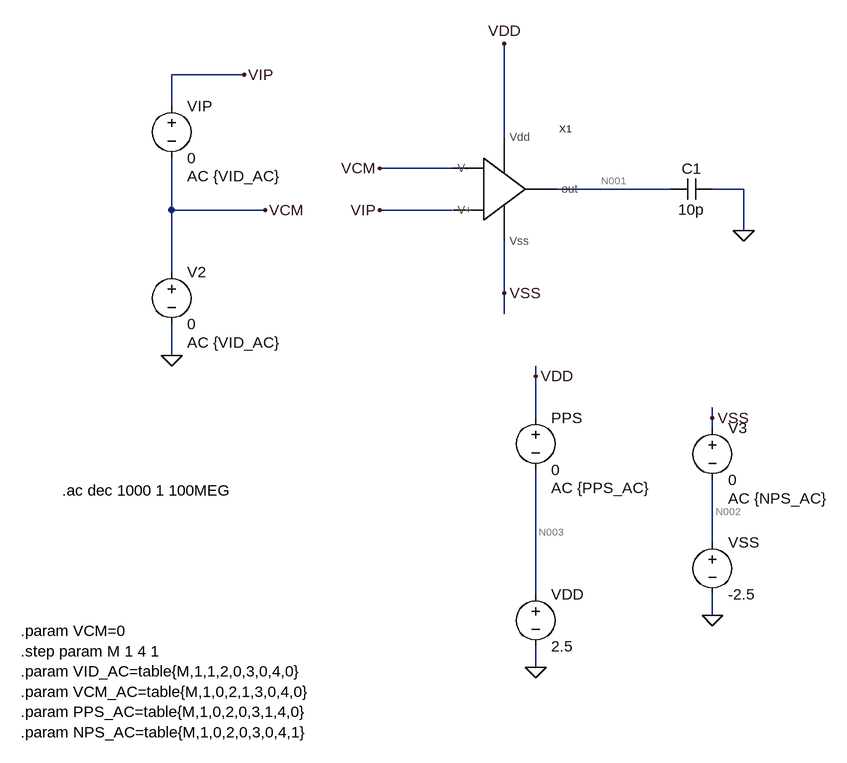
[diagram p0: schematic Draft3.asc]
Draft3.asc, the LTspice schematic file:
Version 4
SHEET 1 880 788
WIRE -432 -272 -544 -272
WIRE -544 -224 -544 -272
WIRE -32 -176 -32 -320
WIRE -112 -128 -224 -128
WIRE 224 -96 48 -96
WIRE 336 -96 288 -96
WIRE -544 -64 -544 -144
WIRE -400 -64 -544 -64
WIRE -112 -64 -224 -64
WIRE 336 -32 336 -96
WIRE -544 32 -544 -64
WIRE -32 64 -32 -16
WIRE -32 96 -32 64
WIRE -544 160 -544 112
WIRE 16 192 16 176
WIRE 16 256 16 192
WIRE 288 256 288 240
WIRE 288 272 288 256
WIRE 288 448 288 352
WIRE 16 528 16 336
WIRE 288 560 288 528
WIRE 16 640 16 608
FLAG -544 160 0
FLAG 288 560 0
FLAG 336 -32 0
FLAG 16 640 0
FLAG -400 -64 VCM
FLAG -224 -128 VCM
FLAG -224 -64 VIP
FLAG -432 -272 VIP
FLAG 16 192 VDD
FLAG -32 -320 VDD
FLAG -32 64 VSS
FLAG 288 256 VSS
DATAFLAG 208 -96 ""
SYMBOL OPAMP -144 -96 R0
SYMATTR InstName X1
SYMBOL voltage -544 -240 R0
WINDOW 123 24 124 Left 2
WINDOW 39 0 0 Left 0
SYMATTR Value2 AC {VID_AC}
SYMATTR InstName VIP
SYMATTR Value 0
SYMBOL voltage -544 16 R0
WINDOW 123 24 124 Left 2
WINDOW 39 0 0 Left 0
SYMATTR Value2 AC {VID_AC}
SYMATTR InstName V2
SYMATTR Value 0
SYMBOL voltage 288 256 R0
WINDOW 123 24 124 Left 2
WINDOW 39 0 0 Left 0
SYMATTR Value2 AC {NPS_AC}
SYMATTR InstName V3
SYMATTR Value 0
SYMBOL voltage 288 432 R0
WINDOW 123 0 0 Left 0
WINDOW 39 0 0 Left 0
SYMATTR InstName VSS
SYMATTR Value -2.5
SYMBOL cap 288 -112 R90
WINDOW 0 0 32 VBottom 2
WINDOW 3 32 32 VTop 2
SYMATTR InstName C1
SYMATTR Value 10p
SYMBOL voltage 16 240 R0
WINDOW 123 24 124 Left 2
WINDOW 39 0 0 Left 0
SYMATTR Value2 AC {PPS_AC}
SYMATTR InstName PPS
SYMATTR Value 0
SYMBOL voltage 16 512 R0
WINDOW 123 0 0 Left 0
WINDOW 39 0 0 Left 0
SYMATTR InstName VDD
SYMATTR Value 2.5
TEXT -712 368 Left 2 !.ac dec 1000 1 100MEG
TEXT -776 584 Left 2 !.param VCM=0\n.step param M 1 4 1\n.param VID_AC=table{M,1,1,2,0,3,0,4,0}\n.param VCM_AC=table{M,1,0,2,1,3,0,4,0}\n.param PPS_AC=table{M,1,0,2,0,3,1,4,0}\n.param NPS_AC=table{M,1,0,2,0,3,0,4,1}

The netlist it stands for:
* Draft3.asc
XX1 VDD VSS VCM VIP N001 OPAMP  ; pins Vdd Vss V- V+ out
VIP VIP VCM 0 AC {VID_AC}
V2 VCM 0 0 AC {VID_AC}
V3 VSS N002 0 AC {NPS_AC}
VSS N002 0 -2.5
C1 0 N001 10p
V§PPS VDD N003 0 AC {PPS_AC}
VDD N003 0 2.5
.ac dec 1000 1 100MEG
.param VCM=0
.step param M 1 4 1
.param VID_AC=table{M,1,1,2,0,3,0,4,0}
.param VCM_AC=table{M,1,0,2,1,3,0,4,0}
.param PPS_AC=table{M,1,0,2,0,3,1,4,0}
.param NPS_AC=table{M,1,0,2,0,3,0,4,1}
.backanno
.end

* Results of the author's LTspice run, read from the files saved beside the schematic
* Operating Point (first step), zero values left out:
*   m = 1 
*   V(vdd) = 2.5 V
*   V(vss) = -2.5 V
*   V(n001) = 608.4 mV
*   V(n002) = -2.5 V
*   V(n003) = 2.5 V
*   I(V3) = 191.2 µA
*   I(Vss) = 191.2 µA
*   I(Pps) = -191.2 µA
*   I(Vdd) = -191.2 µA
*   Ix(x1:VDD) = 191.2 µA
*   Ix(x1:VSS) = -191.2 µA